# Altium schematic sheet Guide_laser.SchDoc
size 420 x 297 mm; Address1: Address1; Address2: Address2; Address3: Address3; Address4: Address4; DocumentNumber: *Э3; SheetNumber: 6; SheetTotal: 11; DocumentType: Схема электрическая *
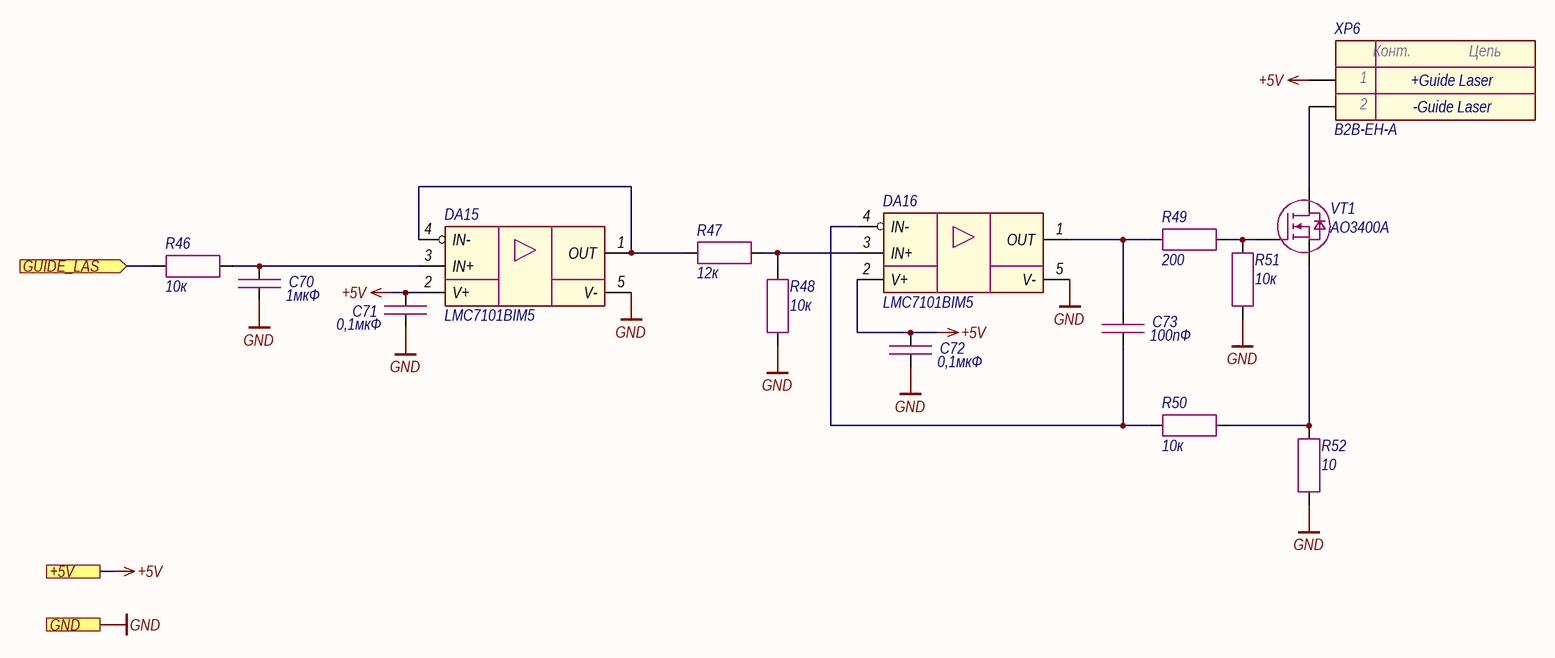
[diagram p0: Guide_laser.SchDoc]

## Parts
C70  1мкФ  [CAP_0603]
C71  0,1мкФ  [CAP_0603]
C72  0,1мкФ  [CAP_0603]
C73  100пФ  [CAP_0603]
DA15  LMC7101BIM5  [SOT-23-5]
DA16  LMC7101BIM5  [SOT-23-5]
R46  10к  [RES_0603]
R47  12к  [RES_0603]
R48  10к  [RES_0603]
R49  200  [RES_0603]
R50  10к  [RES_0603]
R51  10к  [RES_0603]
R52  10  [RES_1210]
VT1  AO3400A  [SOT-23-3]
XP6  B2B-EH-A  [B2B-EH-A]

## Ports
+5V (see Main[2A], LD_driver[1D]), GND (see Main[2A], Ethernet[3D], Fiber_interlock[2C], Flow_sensor[2C], Hardwiring[3D], Indication[1C], LD_driver[1D], Power_supply[1D]), GUIDE_LAS (in, see Main[3A])

## Nets
+5V: C71.1 C72.1 DA15.2(V+) DA16.2(V+) XP6.1 ; port +5V
GND: C70.2 C71.2 C72.2 DA15.5(V-) DA16.5(V-) R48.2 R51.1 R52.1 ; port GND
GUIDE_LAS: R46.1 ; port GUIDE_LAS
NetC70_1: C70.1 DA15.3(IN+) R46.2
NetC73_1: C73.1 DA16.1(OUT) R49.1
NetC73_2: C73.2 DA16.4(IN-) R50.1
NetDA15_1: DA15.1(OUT) DA15.4(IN-) R47.1
NetDA16_3: DA16.3(IN+) R47.2 R48.1
NetR49_2: R49.2 R51.2 VT1.1(G)
NetR50_2: R50.2 R52.2 VT1.2(S)
NetVT1_3: VT1.3(D) XP6.2

## Notes on the sheet
- +Guide Laser
- -Guide Laser
- Подп. и дата
- Инв. № дубл.
- Взам. инв. №
- Инв. № подл.
- Изм.
- Лист
- № докум.
- Подп.
- Дата
- Копировал
- Формат А3
- (in symbol Connector-2) Конт.; Цепь

## Library data of the parts
C70 = Capacitor: Manufacturer: Murata; Model: GRM188R61H105KAALD; Value: 1мкФ; Document: *
C71 C72 = Capacitor: Manufacturer: Murata; Model: GRM188R71H104KA93D; Value: 0,1мкФ; Document: *
C73 = Capacitor: Manufacturer: Murata; Model: GRM1885C1H101JA01D; Value: 100пФ; Document: *
DA15 DA16 = LMC7101: Manufacturer: Texas Instruments; Model: LMC7101BIM5; Document: *
R46 R48 R50 R51 = Resistor: Manufacturer: Yageo; Model: RC0603FR-0710KL; Value: 10к; Document: *
R47 = Resistor: Manufacturer: Yageo; Model: RC0603FR-0712KL; Value: 12к; Document: *
R49 = Resistor: Manufacturer: Yageo; Model: RC0603FR-07200RL; Value: 200; Document: *
R52 = Resistor: Manufacturer: Yageo; Model: RC1210FR-0710RL; Value: 10; Document: *
VT1 = MOSFET N-channel: Manufacturer: UMW; Model: AO3400A; Document: *
XP6 = Connector-2: Manufacturer: JST; Model: B2B-EH-A; Document: *